# EAGLE design RGB Led Controller (EAGLE 7.6.0)
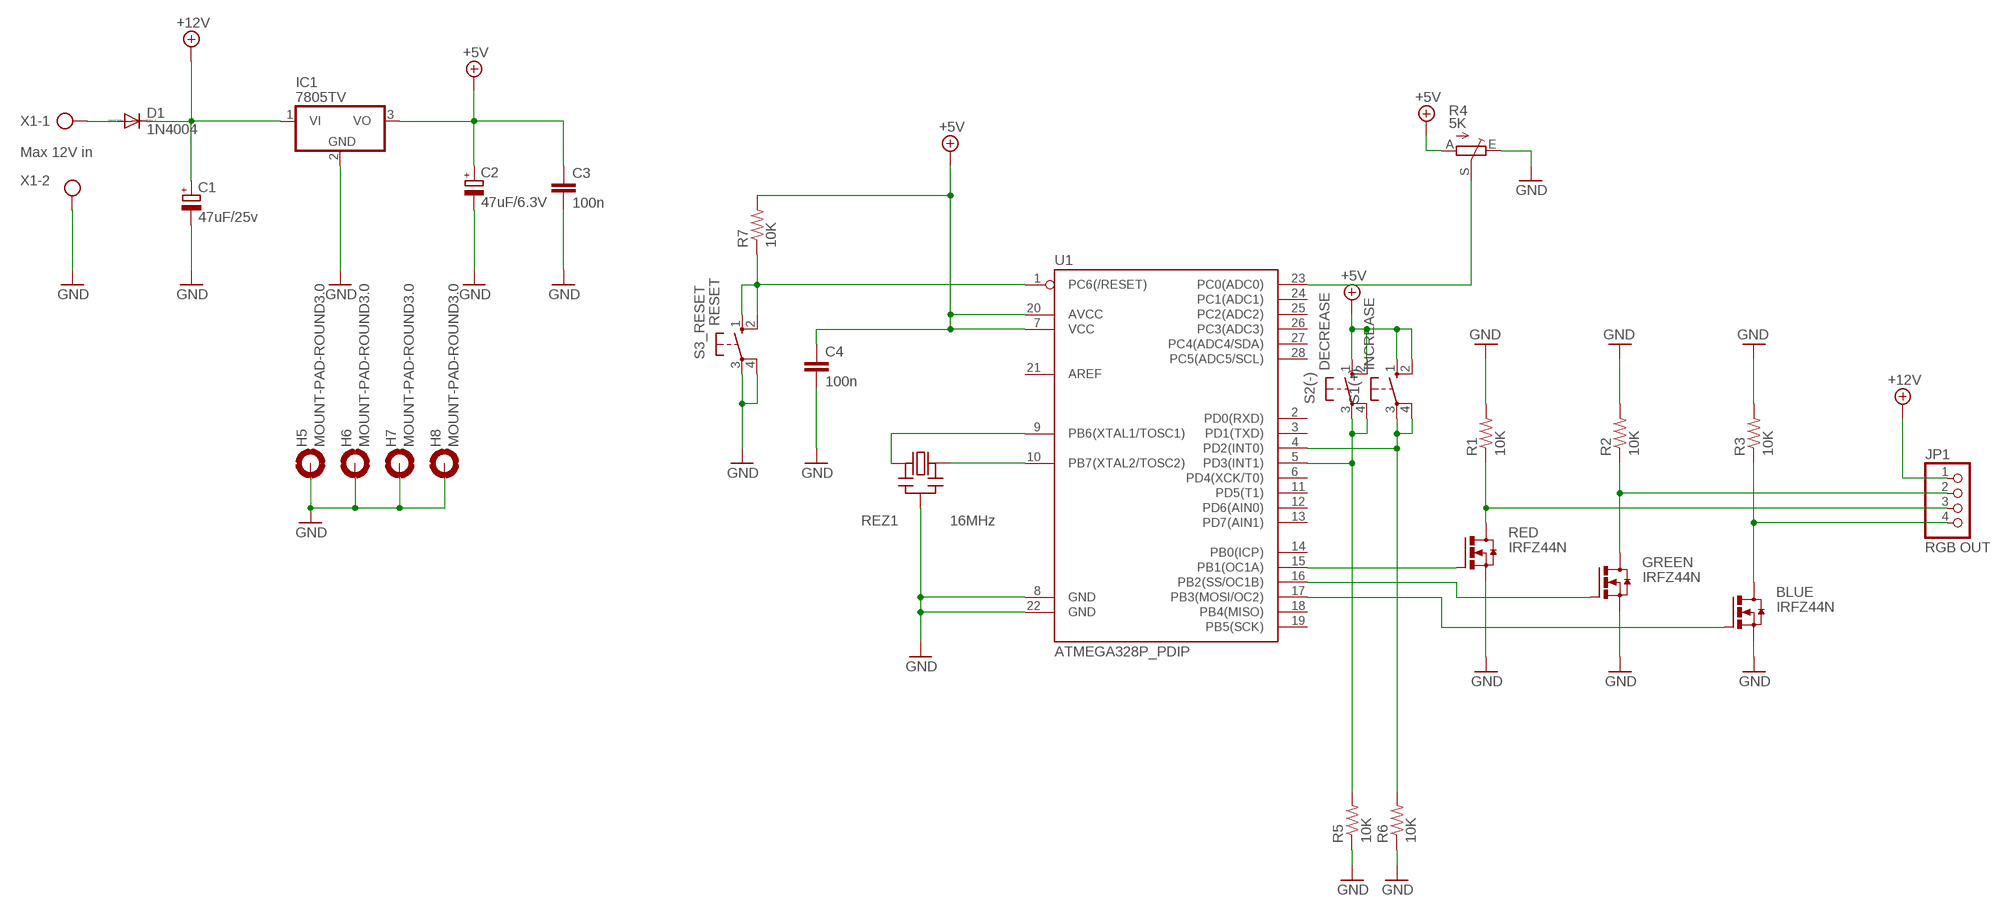
[diagram p0: schematic, sheet 1]

## Parts
BLUE  IRFZ44N  [TO220V]
C1  47uF/25v  CPOL-EUE5-10.5  [E5-10,5]
C2  47uF/6.3V  CPOL-EUE5-10.5  [E5-10,5]
C3  100n  CAPEZ  [CAP-PTH-SMALLEZ]
C4  100n  CAPEZ  [CAP-PTH-SMALLEZ]
D1  1N4004  [DO41-10]
GREEN  IRFZ44N  [TO220V]
H5  MOUNT-PAD-ROUND3.0  [3,0-PAD]
H6  MOUNT-PAD-ROUND3.0  [3,0-PAD]
H7  MOUNT-PAD-ROUND3.0  [3,0-PAD]
H8  MOUNT-PAD-ROUND3.0  [3,0-PAD]
IC1  7805TV  [TO220V]
JP1  RGB OUT  PINHD-1X4  [1X04]
R1  10K  R-US_0309/12  [0309/12]
R2  10K  R-US_0309/12  [0309/12]
R3  10K  R-US_0309/12  [0309/12]
R4  5K  TRIM_EU-CIP20C-6MM  [CIP20C-6MM]
R5  10K  R-US_0309/12  [0309/12]
R6  10K  R-US_0309/12  [0309/12]
R7  10K  R-US_0309/12  [0309/12]
RED  IRFZ44N  [TO220V]
REZ1  16MHz  CERMOSCILL-THM  [CERM_OSC]
S1(+)  INCREASE  10-XX  [B3F-10XX]
S2(-)  DECREASE  10-XX  [B3F-10XX]
S3_RESET  RESET  10-XX  [B3F-10XX]
U1  ATMEGA328P_PDIP  [DIL28-3]
X1  Max 12V in  AK300/2  [AK300/2]

## Nets
+5V: C2.+ C3.1 C4.1 IC1.3(VO) R4.A R7.2 S1(+).1(S) S1(+).2(S1) S2(-).1(S) S2(-).2(S1) U1.7(VCC) U1.20(AVCC)
+12V [hi_power]: C1.+ D1.C IC1.1(VI) JP1.1
GND: BLUE.3(S) C1.- C2.- C3.2 C4.2 GREEN.3(S) H5.B3,0(MOUNT) H6.B3,0(MOUNT) H7.B3,0(MOUNT) H8.B3,0(MOUNT) IC1.2(GND) R1.2 R2.2 R3.2 R4.E R5.1 R6.1 RED.3(S) REZ1.P$2(GND) S3_RESET.3(P) S3_RESET.4(P1) U1.8(GND) U1.22(GND) X1.2
N$1: REZ1.P$1(IN) U1.9(PB6(XTAL1/TOSC1))
N$2: REZ1.P$3(OUT) U1.10(PB7(XTAL2/TOSC2))
N$3: RED.1(G) U1.15(PB1(OC1A))
N$4: GREEN.1(G) U1.16(PB2(SS/OC1B))
N$5: BLUE.1(G) U1.17(PB3(MOSI/OC2))
N$6 [hi_power]: BLUE.2(D) JP1.4 R3.1
N$7 [hi_power]: GREEN.2(D) JP1.2 R2.1
N$8 [hi_power]: JP1.3 R1.1 RED.2(D)
N$9: R4.S U1.23(PC0(ADC0))
N$10: R7.1 S3_RESET.1(S) S3_RESET.2(S1) U1.1(PC6(/RESET))
N$11 [hi_power]: D1.A X1.1
N$12: R5.2 S2(-).3(P) S2(-).4(P1) U1.5(PD3(INT1))
N$13: R6.2 S1(+).3(P) S1(+).4(P1) U1.4(PD2(INT0))
Unconnected: U1.2(PD0(RXD)) U1.3(PD1(TXD)) U1.6(PD4(XCK/T0)) U1.11(PD5(T1)) U1.12(PD6(AIN0)) U1.13(PD7(AIN1)) U1.14(PB0(ICP)) U1.18(PB4(MISO)) U1.19(PB5(SCK)) U1.21(AREF) U1.24(PC1(ADC1)) U1.25(PC2(ADC2)) U1.26(PC3(ADC3)) U1.27(PC4(ADC4/SDA)) U1.28(PC5(ADC5/SCL))

## Library data of the parts
BLUE GREEN RED = MySemicontuctors:IRFZ44N
C1 C2 = rcl:CPOL-EU: POLARIZED CAPACITOR, European symbol
C3 C4 = SparkFun-Passives:CAP: Capacitor Standard 0603 ceramic capacitor, and 0.1" leaded capacitor.
D1 = diode:1N4004: DIODE general purpose rectifier, 1 A
H5-H8 = holes:MOUNT-PAD-ROUND: MOUNTING PAD, round
IC1 = linear:78*: Positive VOLTAGE REGULATOR Source: http://cache.national.com/ds/LM/LM78L05.pdf http://www.fairchildsemi.com/ds/LM/LM7805.pdf
JP1 = pinhead:PINHD-1X4: PIN HEADER
R1-R3 R5-R7 = adafruit:R-US_: RESISTOR, American symbol
R4 = pot:TRIM_EU-: POTENTIOMETER
REZ1 = adafruit:CERMOSCILL: Ceramic oscillator with built in capacitors such as ZTT-12MHz http://www.ladyada.net/library/eagle
S1(+) S2(-) S3_RESET = switch-omron:10-XX: OMRON SWITCH; MPN: B3F-1000; OC_FARNELL: 176432; OC_NEWARK: 36M3542
U1 = SparkFun-DigitalIC:ATMEGA328P_PDIP: uC used in the Arduino 32kb flash, 1k EEPROM, 2k SRAM This is the through-hole version of this chip.
X1 = con-ptr500:AK300/2: CONNECTOR; OC_FARNELL: unknown; OC_NEWARK: unknown

## Net classes
0 default: width 0.041 mm, clearance 0.041 mm
1 hi_power: width 0.635 mm, clearance 0.029 mm

## Board
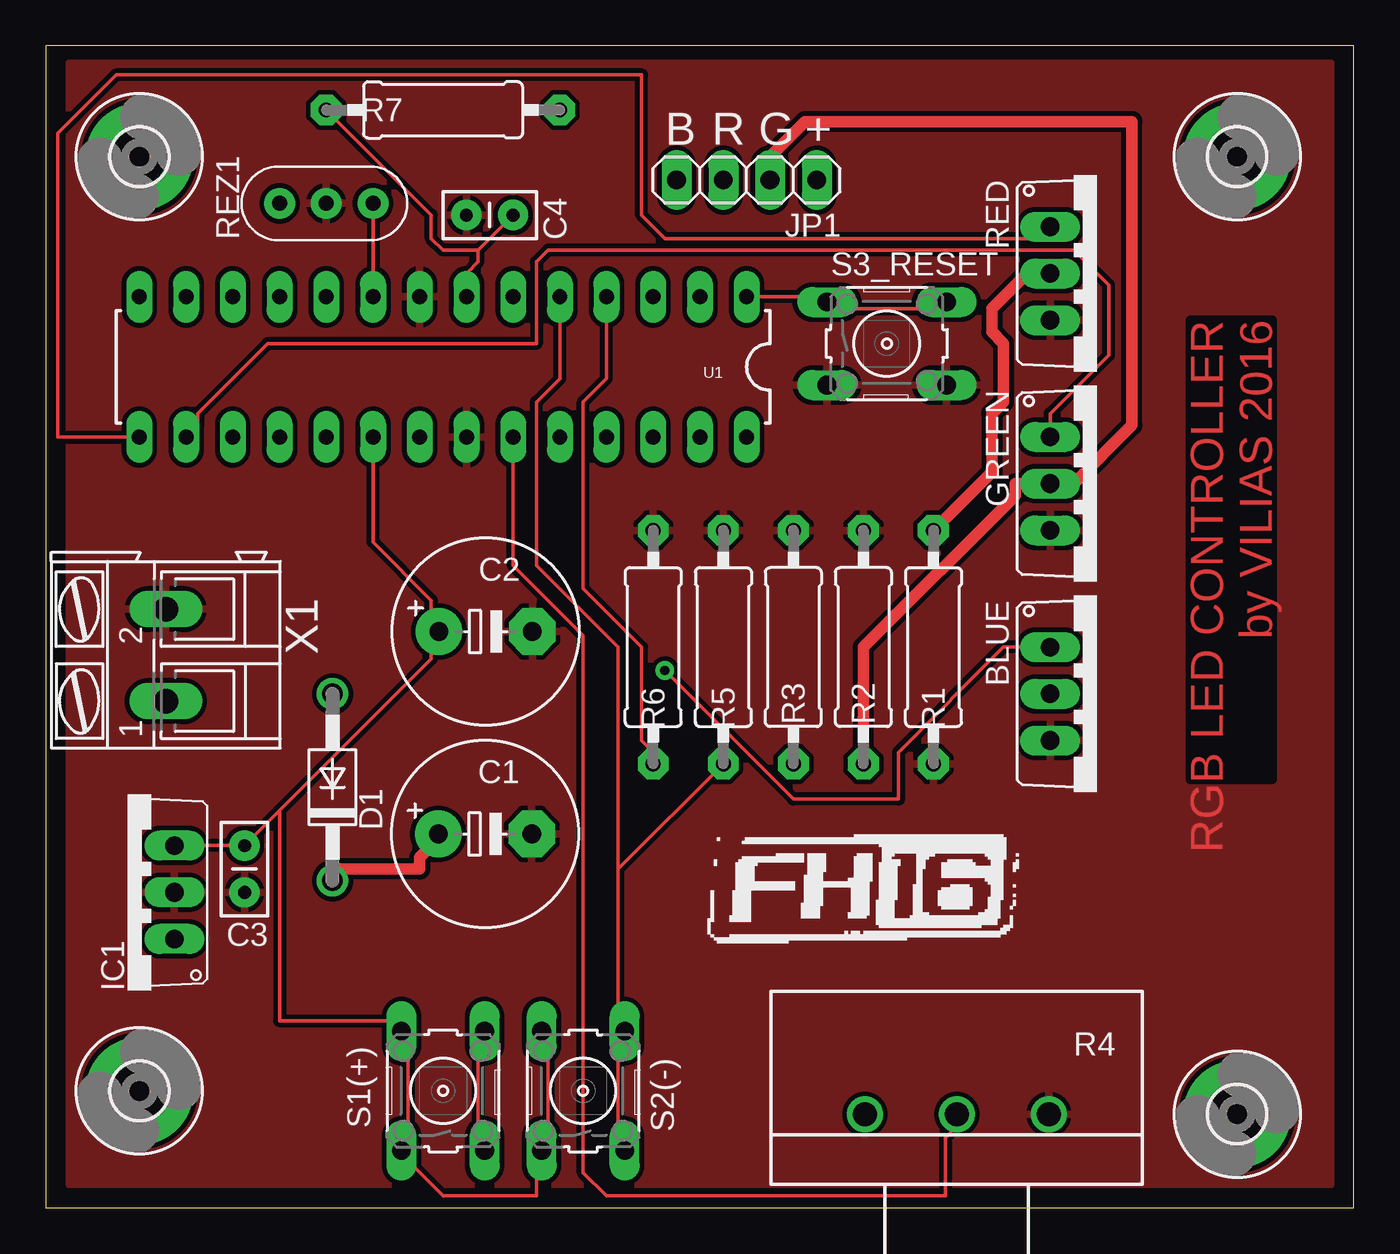
[diagram p1: board, top side]
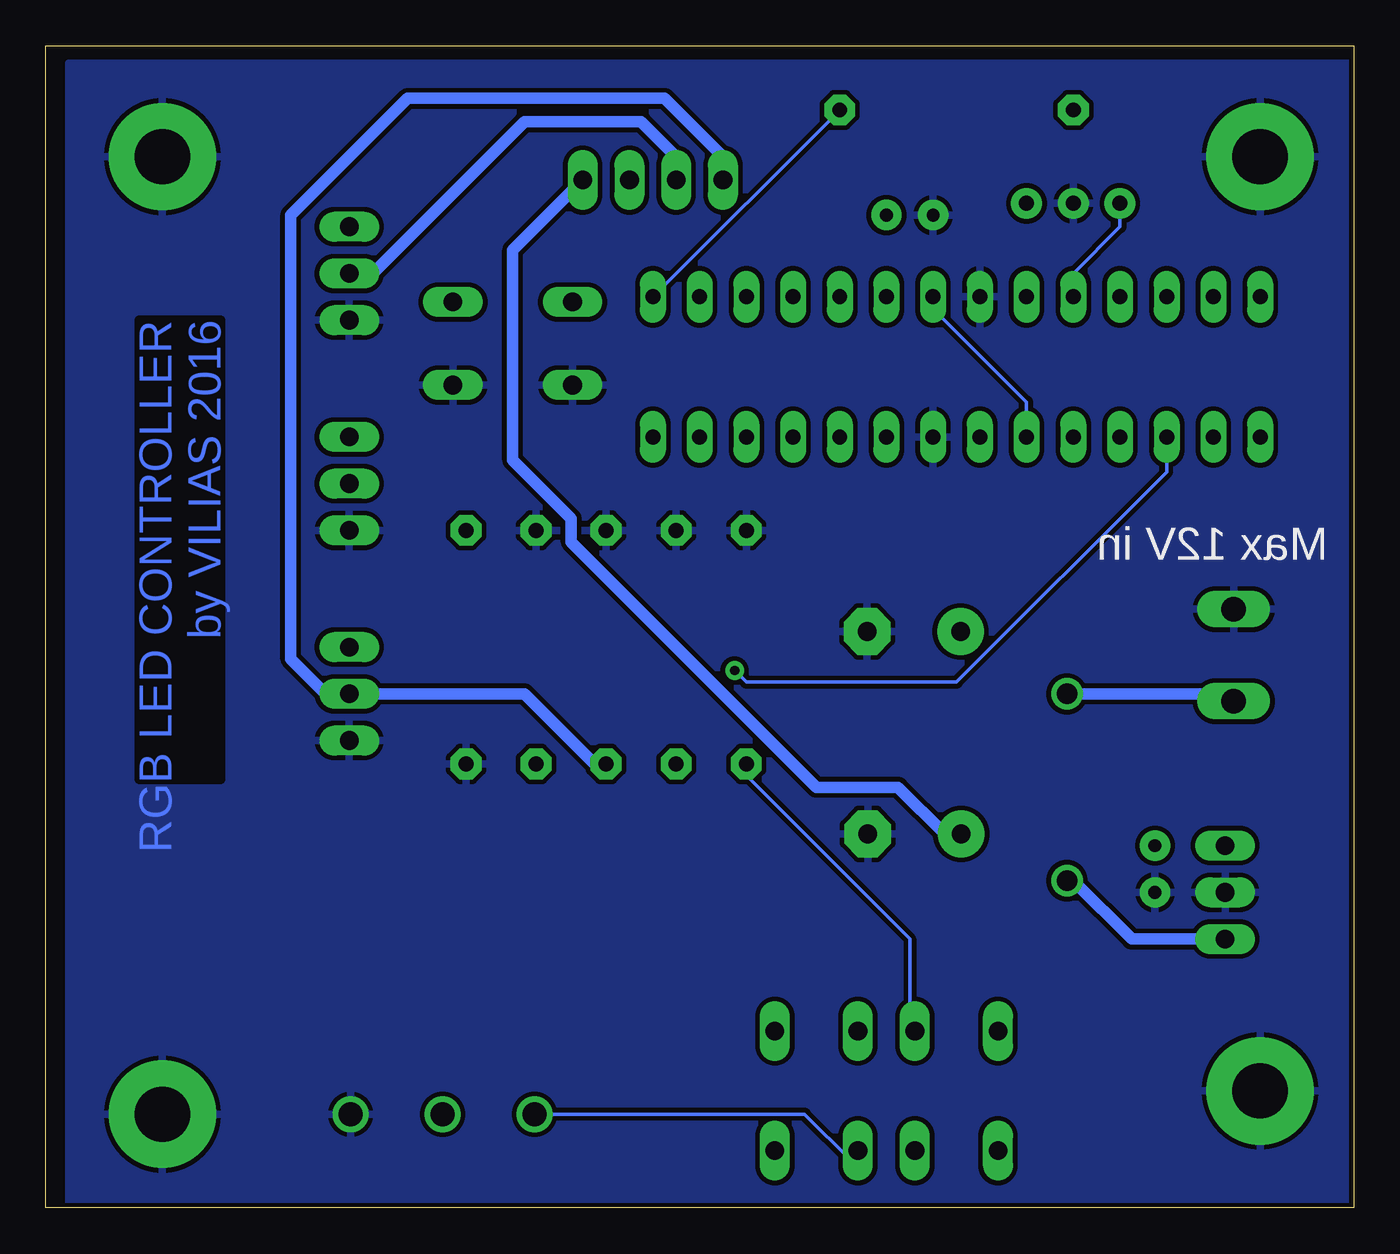
[diagram p2: board, bottom side, seen from below]

Size 71.1 x 63.17 mm. Coordinates in mm from the lower left corner, seen from the top.
Outline: 0,0 71.1,0 71.1,63.17 0,63.17 0,0
Copper layers (1*16): Top 0.035mm / dielectric 1.5mm / Bottom 0.035mm
Design rules "vilias_clearance10mil": minimum track width 8mil, minimum drill 20mil, track to track 10mil, track to pad 10mil, pad to pad 10mil, via to via 10mil, smd to smd 10mil, copper to edge 10mil, drill to drill 8mil, minimum pad ring 12mil, minimum via ring 10mil, stop-mask expansion 4mil, vias tented up to drill 25mil, thermal gap 10mil

### Footprints (pad centres in the part's own frame; a part is rotated, then mirrored left to right if it is on the bottom)
TO220V = drill 1.016 long: 1 -2.54,0; 2 0,0; 3 2.54,0
E5-10,5 = drill 1.016 pad 2.54: + -2.54,0 | drill 1.016 pad 2.54 octagon: - 2.54,0
CAP-PTH-SMALLEZ = drill 0.7 pad 1.651: 1 0,0; 2 2.54,0
DO41-10 = drill 1.118: A 5.08,0; C -5.08,0
3,0-PAD = drill 3 pad 5.842: B3,0 0,0
TO220V' = drill 1.016 long: 1 -2.54,-2.54; 2 0,-2.54; 3 2.54,-2.54
1X04 = drill 1.016 long: 1 -3.81,0; 2 -1.27,0; 3 1.27,0; 4 3.81,0
0309/12 = drill 0.813 pad 1.676 octagon: 1 -6.35,0; 2 6.35,0
CIP20C-6MM = drill 1.3 pad 1.93: A -5,0; E 5,0; S 0,0
CERM_OSC = drill 0.813 pad 1.676: P$1 -2.54,0; P$2 0,0; P$3 2.54,0
B3F-10XX = drill 1.016 long: 1 -3.251,2.261; 2 3.251,2.261; 3 -3.251,-2.261; 4 3.251,-2.261
DIL28-3 = drill 0.813 long: 1 -16.51,-3.81; 2 -13.97,-3.81; 3 -11.43,-3.81; 4 -8.89,-3.81; 5 -6.35,-3.81; 6 -3.81,-3.81; 7 -1.27,-3.81; 8 1.27,-3.81; 9 3.81,-3.81; 10 6.35,-3.81; 11 8.89,-3.81; 12 11.43,-3.81; 13 13.97,-3.81; 14 16.51,-3.81; 15 16.51,3.81; 16 13.97,3.81; 17 11.43,3.81; 18 8.89,3.81; 19 6.35,3.81; 20 3.81,3.81; 21 1.27,3.81; 22 -1.27,3.81; 23 -3.81,3.81; 24 -6.35,3.81; 25 -8.89,3.81; 26 -11.43,3.81; 27 -13.97,3.81; 28 -16.51,3.81
AK300/2 = drill 1.321 long: 1 -2.515,0; 2 2.489,0

### Placement (x,y rotation side)
BLUE  54.61,27.94 270 top
C1  23.88,20.32 0 top
C2  23.91,31.33 0 top
C3  10.79,19.68 270 top
C4  25.4,53.98 180 top
D1  15.58,22.86 90 top
GREEN  54.61,39.37 270 top
H5  5.08,6.35 0 top
H6  5.08,57.15 0 top
H7  64.77,57.15 0 top
H8  64.77,5.08 0 top
IC1  7805TV  [TO220V']  4.45,17.14 90 top
JP1  38.1,55.88 180 top
R1  48.26,30.48 270 top
R2  44.45,30.48 90 top
R3  40.64,30.48 90 top
R4  49.53,5.08 0 top
R5  36.83,30.48 270 top
R6  33.02,30.48 270 top
R7  21.59,59.69 180 top
RED  54.61,50.8 270 top
REZ1  15.24,54.61 180 top
S1(+)  21.59,6.35 90 top
S2(-)  29.21,6.35 90 top
S3_RESET  45.72,46.99 0 top
U1  21.59,45.72 180 top
X1  6.52,30.06 90 top

### Tracks (layer width: path | path; a pad name or v marks a point on that pad's centre or on a via)
+5V
  Top 0.203: S2(-).2 27.3,9.53 27.3,3.17 S2(-).1 26.67,2.54 26.67,0.64 21.59,0.64 19.68,2.54 S1(+).1 19.68,3.17 19.68,9.53 S1(+).2 19.05,10.16 12.7,10.16 12.7,21.59 | 23.5,52.07 C4.1 | 23.5,52.07 23.5,51.44 22.86,50.8 U1.7 | R7.2 20.95,53.98 20.95,52.7 21.59,52.07 23.5,52.07 | IC1.3 C3.1 12.7,21.59 | 12.7,21.59 20.95,29.84 20.95,31.11 C2.+ 20.95,31.75 20.95,33.02 17.78,36.2 U1.20
  Bottom 0.203: R4.A 29.84,5.08 27.3,2.54 S2(-).1 | U1.20 17.78,43.81 22.86,48.9 U1.7
+12V
  Top 0.635: D1.C 15.88,18.41 20.32,18.41 20.32,19.05 20.95,19.68 20.95,20.32 C1.+
  Bottom 0.635: IC1.1 12.06,14.61 15.24,17.78 D1.C | JP1.1 45.72,52.07 45.72,40.64 42.55,37.47 42.55,36.2 29.21,22.86 24.77,22.86 22.23,20.32 C1.+
GND
  pour Bottom: 0,62.23 69.85,62.23 69.85,0 0,0
  pour Top: 1.27,62.23 69.85,62.23 69.85,1.27 1.27,1.27
N$1
  Top 0.203: REZ1.P$1 U1.9
N$2
  Bottom 0.203: U1.10 15.24,50.8 12.7,53.34 REZ1.P$3
N$3
  Top 0.203: U1.15 0.64,41.91 0.64,58.42 3.81,61.59 32.38,61.59 32.38,53.98 33.66,52.7 54.61,52.7 RED.1
N$4
  Top 0.203: U1.16 8.26,42.55 8.26,43.18 12.06,46.99 26.67,46.99 26.67,51.44 27.3,52.07 55.88,52.07 57.78,50.16 57.78,46.35 54.61,43.18 GREEN.1
N$5  (via drill 0.51)
  Top 0.203: v33.66,29.21 40.64,22.23 46.35,22.23 46.35,24.77 52.07,30.48 BLUE.1
  Bottom 0.203: U1.17 10.16,40.01 21.59,28.57 33.02,28.57 v33.66,29.21
N$6
  Bottom 0.635: R3.1 41.27,24.13 45.09,27.94 BLUE.2 55.88,27.94 57.78,29.84 57.78,53.98 51.44,60.33 37.47,60.33 34.29,57.15 JP1.4
N$7
  Top 0.635: R2.1 44.45,30.48 52.7,38.73 52.7,39.37 GREEN.2 55.88,39.37 59.05,42.55 59.05,59.05 41.27,59.05 39.37,57.15 JP1.2
N$8
  Top 0.635: R1.1 51.44,40.01 51.44,43.18 52.07,43.81 52.07,46.99 51.44,47.62 51.44,48.9 53.34,50.8 RED.2
  Bottom 0.635: JP1.3 36.83,57.15 38.73,59.05 45.09,59.05 53.34,50.8 RED.2
N$9
  Top 0.203: U1.23 25.4,34.92 29.21,31.11 29.21,1.91 30.48,0.64 48.9,0.64 48.9,3.81 49.53,4.45 R4.S
N$10
  Top 0.203: U1.1 41.91,49.53 S3_RESET.1 42.55,48.9 48.9,48.9 S3_RESET.2
  Bottom 0.203: U1.1 R7.1
N$11
  Bottom 0.635: D1.A 15.24,27.94 6.99,27.94 X1.1
N$12
  Top 0.203: U1.5 27.94,45.09 26.67,43.81 26.67,34.92 31.11,30.48 31.11,18.41 | 31.11,18.41 31.11,10.16 S2(-).4 31.11,9.53 31.11,3.17 S2(-).3 | 31.11,18.41 R5.2
N$13
  Top 0.203: S1(+).3 23.5,3.17 23.5,9.53 S1(+).4 | U1.4 30.48,45.09 29.21,43.81 29.21,33.66 32.38,30.48 32.38,25.4 33.02,24.77 R6.2
  Bottom 0.203: R6.2 33.02,23.5 24.13,14.61 24.13,10.16 S1(+).4

### Text on the board
Top: RGB LED CONTROLLER / by VILIAS 2016
Bottom: RGB LED CONTROLLER / by VILIAS 2016
_tsilk: B | R | G | +